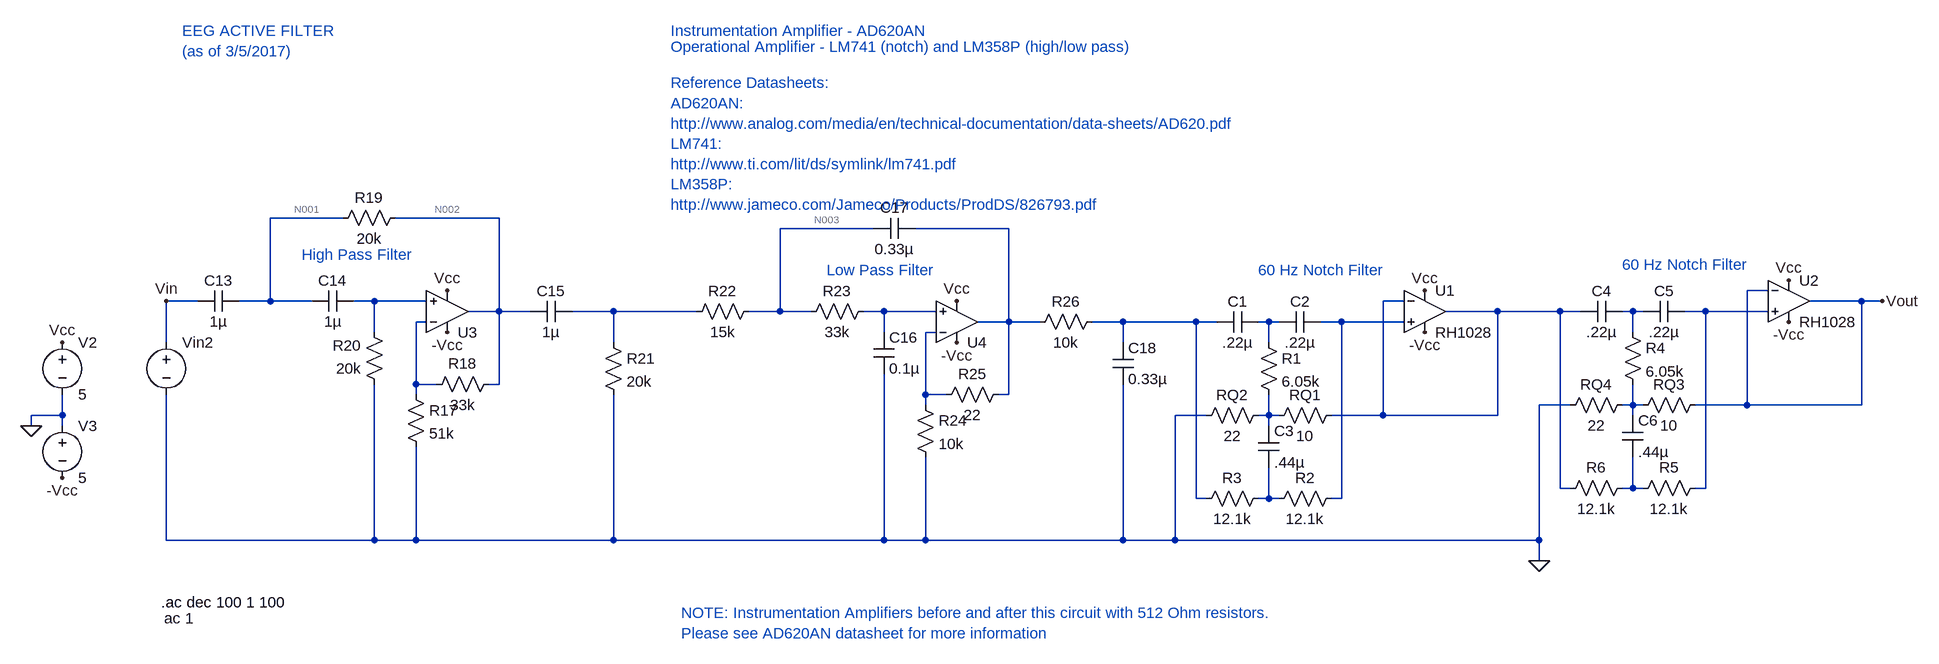
[diagram p0: schematic ActiveElectrode.asc]
ActiveElectrode.asc, the LTspice schematic file:
Version 4
SHEET 1 880 680
WIRE -4240 -992 -4352 -992
WIRE -4000 -992 -4160 -992
WIRE -3424 -976 -3568 -976
WIRE -3216 -976 -3360 -976
WIRE -2048 -880 -2080 -880
WIRE -4464 -864 -4512 -864
WIRE -4352 -864 -4352 -992
WIRE -4352 -864 -4400 -864
WIRE -4288 -864 -4352 -864
WIRE -4192 -864 -4224 -864
WIRE -4112 -864 -4192 -864
WIRE -2608 -864 -2640 -864
WIRE -1904 -864 -1984 -864
WIRE -1872 -864 -1904 -864
WIRE -4000 -848 -4000 -992
WIRE -4000 -848 -4048 -848
WIRE -3952 -848 -4000 -848
WIRE -3824 -848 -3888 -848
WIRE -3696 -848 -3824 -848
WIRE -3568 -848 -3568 -976
WIRE -3568 -848 -3616 -848
WIRE -3520 -848 -3568 -848
WIRE -3408 -848 -3440 -848
WIRE -3328 -848 -3408 -848
WIRE -2464 -848 -2544 -848
WIRE -2368 -848 -2464 -848
WIRE -2336 -848 -2368 -848
WIRE -2256 -848 -2272 -848
WIRE -2240 -848 -2256 -848
WIRE -2144 -848 -2176 -848
WIRE -2048 -848 -2144 -848
WIRE -4112 -832 -4128 -832
WIRE -3216 -832 -3216 -976
WIRE -3216 -832 -3264 -832
WIRE -3168 -832 -3216 -832
WIRE -3040 -832 -3088 -832
WIRE -2928 -832 -3040 -832
WIRE -2896 -832 -2928 -832
WIRE -2816 -832 -2832 -832
WIRE -2800 -832 -2816 -832
WIRE -2704 -832 -2736 -832
WIRE -2608 -832 -2704 -832
WIRE -4192 -816 -4192 -864
WIRE -3408 -816 -3408 -848
WIRE -3328 -816 -3344 -816
WIRE -2256 -816 -2256 -848
WIRE -4512 -800 -4512 -864
WIRE -3824 -800 -3824 -848
WIRE -3040 -800 -3040 -832
WIRE -2816 -800 -2816 -832
WIRE -4128 -736 -4128 -832
WIRE -4096 -736 -4128 -736
WIRE -4000 -736 -4000 -848
WIRE -4000 -736 -4016 -736
WIRE -4128 -720 -4128 -736
WIRE -3344 -720 -3344 -816
WIRE -3312 -720 -3344 -720
WIRE -3216 -720 -3216 -832
WIRE -3216 -720 -3232 -720
WIRE -3344 -704 -3344 -720
WIRE -2352 -704 -2400 -704
WIRE -2256 -704 -2256 -736
WIRE -2256 -704 -2272 -704
WIRE -2240 -704 -2256 -704
WIRE -2080 -704 -2080 -880
WIRE -2080 -704 -2160 -704
WIRE -1904 -704 -1904 -864
WIRE -1904 -704 -2080 -704
WIRE -4672 -688 -4672 -720
WIRE -4672 -688 -4720 -688
WIRE -2912 -688 -2960 -688
WIRE -2816 -688 -2816 -720
WIRE -2816 -688 -2832 -688
WIRE -2800 -688 -2816 -688
WIRE -2640 -688 -2640 -864
WIRE -2640 -688 -2720 -688
WIRE -2464 -688 -2464 -848
WIRE -2464 -688 -2640 -688
WIRE -2256 -688 -2256 -704
WIRE -4720 -672 -4720 -688
WIRE -4672 -672 -4672 -688
WIRE -2816 -672 -2816 -688
WIRE -2368 -576 -2368 -848
WIRE -2352 -576 -2368 -576
WIRE -2256 -576 -2256 -624
WIRE -2256 -576 -2272 -576
WIRE -2240 -576 -2256 -576
WIRE -2144 -576 -2144 -848
WIRE -2144 -576 -2160 -576
WIRE -2928 -560 -2928 -832
WIRE -2912 -560 -2928 -560
WIRE -2816 -560 -2816 -608
WIRE -2816 -560 -2832 -560
WIRE -2800 -560 -2816 -560
WIRE -2704 -560 -2704 -832
WIRE -2704 -560 -2720 -560
WIRE -4512 -496 -4512 -720
WIRE -4192 -496 -4192 -736
WIRE -4192 -496 -4512 -496
WIRE -4128 -496 -4128 -640
WIRE -4128 -496 -4192 -496
WIRE -3824 -496 -3824 -720
WIRE -3824 -496 -4128 -496
WIRE -3408 -496 -3408 -752
WIRE -3408 -496 -3824 -496
WIRE -3344 -496 -3344 -624
WIRE -3344 -496 -3408 -496
WIRE -3040 -496 -3040 -736
WIRE -3040 -496 -3344 -496
WIRE -2960 -496 -2960 -688
WIRE -2960 -496 -3040 -496
WIRE -2400 -496 -2400 -704
WIRE -2400 -496 -2960 -496
WIRE -2400 -464 -2400 -496
FLAG -4080 -880 Vcc
FLAG -4080 -816 -Vcc
FLAG -3296 -864 Vcc
FLAG -3296 -800 -Vcc
FLAG -4672 -592 -Vcc
FLAG -4672 -800 Vcc
FLAG -2576 -880 Vcc
FLAG -2576 -816 -Vcc
FLAG -2016 -896 Vcc
FLAG -2016 -832 -Vcc
FLAG -1872 -864 Vout
FLAG -2400 -464 0
FLAG -4720 -672 0
FLAG -4512 -864 Vin
SYMBOL res -4144 -736 R0
SYMATTR InstName R17
SYMATTR Value 51k
SYMBOL res -4000 -752 R90
WINDOW 0 0 56 VBottom 2
WINDOW 3 32 56 VTop 2
SYMATTR InstName R18
SYMATTR Value 33k
SYMBOL Opamps\\UniversalOpamp2 -4080 -848 M180
SYMATTR InstName U3
SYMBOL res -4144 -1008 R90
WINDOW 0 0 56 VBottom 2
WINDOW 3 32 56 VTop 2
SYMATTR InstName R19
SYMATTR Value 20k
SYMBOL res -4176 -720 R180
WINDOW 0 36 76 Left 2
WINDOW 3 36 40 Left 2
SYMATTR InstName R20
SYMATTR Value 20k
SYMBOL cap -4400 -880 R90
WINDOW 0 0 32 VBottom 2
WINDOW 3 32 32 VTop 2
SYMATTR InstName C13
SYMATTR Value 1µ
SYMBOL cap -4224 -880 R90
WINDOW 0 0 32 VBottom 2
WINDOW 3 32 32 VTop 2
SYMATTR InstName C14
SYMATTR Value 1µ
SYMBOL cap -3888 -864 R90
WINDOW 0 0 32 VBottom 2
WINDOW 3 32 32 VTop 2
SYMATTR InstName C15
SYMATTR Value 1µ
SYMBOL res -3840 -816 R0
SYMATTR InstName R21
SYMATTR Value 20k
SYMBOL res -3600 -864 R90
WINDOW 0 0 56 VBottom 2
WINDOW 3 32 56 VTop 2
SYMATTR InstName R22
SYMATTR Value 15k
SYMBOL cap -3424 -816 R0
SYMATTR InstName C16
SYMATTR Value 0.1µ
SYMBOL res -3424 -864 R90
WINDOW 0 0 56 VBottom 2
WINDOW 3 32 56 VTop 2
SYMATTR InstName R23
SYMATTR Value 33k
SYMBOL cap -3360 -992 R90
WINDOW 0 0 32 VBottom 2
WINDOW 3 32 32 VTop 2
SYMATTR InstName C17
SYMATTR Value 0.33µ
SYMBOL res -3360 -720 R0
SYMATTR InstName R24
SYMATTR Value 10k
SYMBOL res -3216 -736 R90
WINDOW 0 0 56 VBottom 2
WINDOW 3 32 56 VTop 2
SYMATTR InstName R25
SYMATTR Value 22
SYMBOL Opamps\\UniversalOpamp2 -3296 -832 M180
SYMATTR InstName U4
SYMBOL res -3072 -848 R90
WINDOW 0 0 56 VBottom 2
WINDOW 3 32 56 VTop 2
SYMATTR InstName R26
SYMATTR Value 10k
SYMBOL cap -3056 -800 R0
SYMATTR InstName C18
SYMATTR Value 0.33µ
SYMBOL voltage -4512 -816 R0
WINDOW 123 0 0 Left 2
WINDOW 39 0 0 Left 2
WINDOW 3 -3 440 Left 2
SYMATTR Value ac 1
SYMATTR InstName Vin2
SYMBOL voltage -4672 -816 R0
WINDOW 123 0 0 Left 2
WINDOW 39 0 0 Left 2
SYMATTR InstName V2
SYMATTR Value 5
SYMBOL voltage -4672 -688 R0
SYMATTR InstName V3
SYMATTR Value 5
SYMBOL Opamps\\RH1028 -2576 -912 R0
SYMATTR InstName U1
SYMBOL cap -2832 -848 R90
WINDOW 0 0 32 VBottom 2
WINDOW 3 32 32 VTop 2
SYMATTR InstName C1
SYMATTR Value .22µ
SYMBOL cap -2736 -848 R90
WINDOW 0 0 32 VBottom 2
WINDOW 3 32 32 VTop 2
SYMATTR InstName C2
SYMATTR Value .22µ
SYMBOL res -2832 -816 R0
SYMATTR InstName R1
SYMATTR Value 6.05k
SYMBOL res -2704 -704 R90
WINDOW 0 0 56 VBottom 2
WINDOW 3 32 56 VTop 2
SYMATTR InstName RQ1
SYMATTR Value 10
SYMBOL res -2816 -704 R90
WINDOW 0 0 56 VBottom 2
WINDOW 3 32 56 VTop 2
SYMATTR InstName RQ2
SYMATTR Value 22
SYMBOL cap -2832 -672 R0
SYMATTR InstName C3
SYMATTR Value .44µ
SYMBOL res -2704 -576 R90
WINDOW 0 0 56 VBottom 2
WINDOW 3 32 56 VTop 2
SYMATTR InstName R2
SYMATTR Value 12.1k
SYMBOL res -2816 -576 R90
WINDOW 0 0 56 VBottom 2
WINDOW 3 32 56 VTop 2
SYMATTR InstName R3
SYMATTR Value 12.1k
SYMBOL Opamps\\RH1028 -2016 -928 R0
SYMATTR InstName U2
SYMBOL cap -2272 -864 R90
WINDOW 0 0 32 VBottom 2
WINDOW 3 32 32 VTop 2
SYMATTR InstName C4
SYMATTR Value .22µ
SYMBOL cap -2176 -864 R90
WINDOW 0 0 32 VBottom 2
WINDOW 3 32 32 VTop 2
SYMATTR InstName C5
SYMATTR Value .22µ
SYMBOL res -2272 -832 R0
SYMATTR InstName R4
SYMATTR Value 6.05k
SYMBOL res -2144 -720 R90
WINDOW 0 0 56 VBottom 2
WINDOW 3 32 56 VTop 2
SYMATTR InstName RQ3
SYMATTR Value 10
SYMBOL res -2256 -720 R90
WINDOW 0 0 56 VBottom 2
WINDOW 3 32 56 VTop 2
SYMATTR InstName RQ4
SYMATTR Value 22
SYMBOL cap -2272 -688 R0
SYMATTR InstName C6
SYMATTR Value .44µ
SYMBOL res -2144 -592 R90
WINDOW 0 0 56 VBottom 2
WINDOW 3 32 56 VTop 2
SYMATTR InstName R5
SYMATTR Value 12.1k
SYMBOL res -2256 -592 R90
WINDOW 0 0 56 VBottom 2
WINDOW 3 32 56 VTop 2
SYMATTR InstName R6
SYMATTR Value 12.1k
TEXT -4520 -400 Left 2 !.ac dec 100 1 100
TEXT -3736 -1280 Left 2 ;Instrumentation Amplifier - AD620AN
TEXT -3736 -1256 Left 2 ;Operational Amplifier - LM741 (notch) and LM358P (high/low pass)
TEXT -3736 -1200 Left 2 ;Reference Datasheets:\nAD620AN:\nhttp://www.analog.com/media/en/technical-documentation/data-sheets/AD620.pdf\nLM741:\nhttp://www.ti.com/lit/ds/symlink/lm741.pdf\nLM358P:\nhttp://www.jameco.com/Jameco/Products/ProdDS/826793.pdf
TEXT -4304 -936 Left 2 ;High Pass Filter
TEXT -3496 -912 Left 2 ;Low Pass Filter
TEXT -2272 -920 Left 2 ;60 Hz Notch Filter
TEXT -2832 -912 Left 2 ;60 Hz Notch Filter
TEXT -3720 -384 Left 2 ;NOTE: Instrumentation Amplifiers before and after this circuit with 512 Ohm resistors.\nPlease see AD620AN datasheet for more information
TEXT -4488 -1280 Left 2 ;EEG ACTIVE FILTER \n(as of 3/5/2017)

The netlist it stands for:
* ActiveElectrode.asc
R17 N011 0 51k
R18 N002 N011 33k
XU3 N005 N011 -Vcc Vcc N002 level.2 Avol=1Meg GBW=10Meg Slew=10Meg ilimit=25m rail=0 Vos=0 phimargin=45 en=0 enk=0 in=0 ink=0 Rin=500Meg  ; pins IN+ IN- V+ V- OUT
R19 N002 N001 20k
R20 0 N005 20k
C13 N001 Vin 1µ
C14 N005 N001 1µ
C15 N007 N002 1µ
R21 N007 0 20k
R22 N003 N007 15k
C16 N008 0 0.1µ
R23 N008 N003 33k
C17 N004 N003 0.33µ
R24 N015 0 10k
R25 N004 N015 22
XU4 N008 N015 -Vcc Vcc N004 level.2 Avol=1Meg GBW=10Meg Slew=10Meg ilimit=25m rail=0 Vos=0 phimargin=45 en=0 enk=0 in=0 ink=0 Rin=500Meg  ; pins IN+ IN- V+ V- OUT
R26 N012 N004 10k
C18 N012 0 0.33µ
Vin2 Vin 0 ac 1
V2 Vcc 0 5
V3 0 -Vcc 5
XU1 N014 N006 Vcc -Vcc N006 RH1028  ; pins In+ In- V+ V- OUT
C1 N013 N012 .22µ
C2 N014 N013 .22µ
R1 N013 N017 6.05k
RQ1 N006 N017 10
RQ2 N017 0 22
C3 N017 N019 .44µ
R2 N014 N019 12.1k
R3 N019 N012 12.1k
XU2 N010 Vout Vcc -Vcc Vout RH1028  ; pins In+ In- V+ V- OUT
C4 N009 N006 .22µ
C5 N010 N009 .22µ
R4 N009 N016 6.05k
RQ3 Vout N016 10
RQ4 N016 0 22
C6 N016 N018 .44µ
R5 N010 N018 12.1k
R6 N018 N006 12.1k
.ac dec 100 1 100
* Instrumentation Amplifier - AD620AN
* Operational Amplifier - LM741 (notch) and LM358P (high/low pass)
* Reference Datasheets:
* AD620AN:
* http://www.analog.com/media/en/technical-documentation/data-sheets/AD620.pdf
* LM741:
* http://www.ti.com/lit/ds/symlink/lm741.pdf
* LM358P:
* http://www.jameco.com/Jameco/Products/ProdDS/826793.pdf
* High Pass Filter
* Low Pass Filter
* 60 Hz Notch Filter
* 60 Hz Notch Filter
* NOTE: Instrumentation Amplifiers before and after this circuit with 512 Ohm resistors.
* Please see AD620AN datasheet for more information
* EEG ACTIVE FILTER
* (as of 3/5/2017)
.lib UniversalOpamps2.sub
.backanno
.end

* Results of the author's LTspice run, read from the files saved beside the schematic
* Operating Point, zero values left out:
*   V(-vcc) = -5 V
*   V(vcc) = 5 V
*   I(V3) = -14.4 mA
*   I(V2) = -14.4 mA
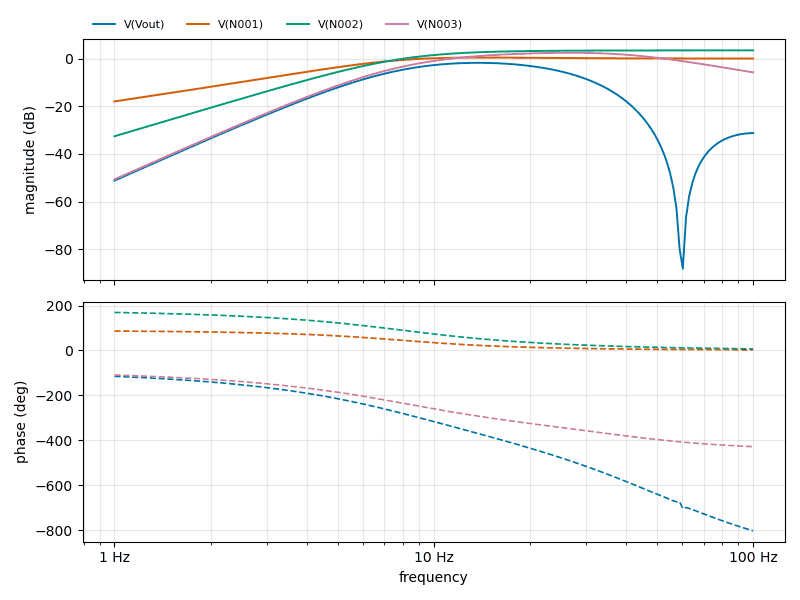
[diagram p1: AC Analysis of ActiveElectrode.asc, plotted from the saved traces]
* AC Analysis, 1 run:
*   V(Vout): -51.20 dB at 1 Hz, -31.21 dB at 100 Hz, peak -1.76 dB at 13.8 Hz, 3 dB below the peak at 7.912 Hz and 23.86 Hz
*   V(N001): -17.97 dB at 1 Hz, 0.02 dB at 100 Hz, peak 0.45 dB at 14.13 Hz, 3 dB below the peak at 5.711 Hz
*   V(N002): -32.58 dB at 1 Hz, 3.47 dB at 100 Hz, peak 3.47 dB at 100 Hz, 3 dB below the peak at 8.516 Hz
*   V(N003): -50.68 dB at 1 Hz, -5.76 dB at 100 Hz, peak 2.46 dB at 26.3 Hz, 3 dB below the peak at 10.52 Hz and 56.58 Hz